# Altium schematic sheet Temp_Mux.SchDoc
size A
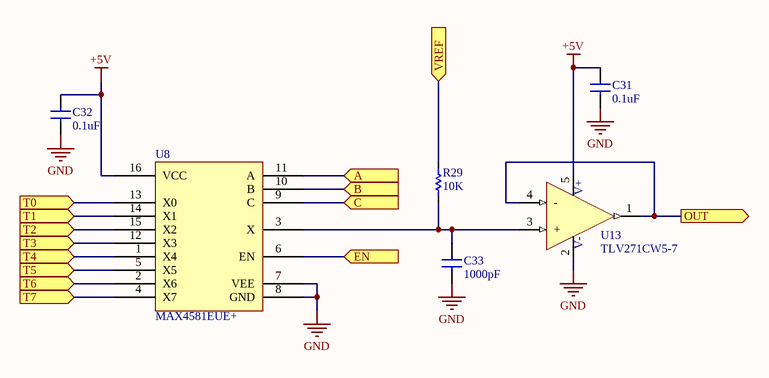
[diagram p0: Temp_Mux.SchDoc]

## Parts
C31  value 0.1uF  [0402_CAPACITOR]  (hidden comment: CAP 0.1uF 16V X7R)
C32  value 0.1uF  [0402_CAPACITOR]  (hidden comment: CAP 0.1uF 16V X7R)
C33  value 1000pF  [0402_CAPACITOR]
R29  value 10K  [0402_Resistor]  (hidden comment: R_0402_10K_1%)
U8  MAX4581EUE+  [TSSOP-16]
U13  TLV271CW5-7  [SOT23-5]

## Ports
A (in), B (in), C (in), EN (in), OUT (out), T0 (in), T1 (in), T2 (in), T3 (in), T4 (in), T5 (in), T6 (in), T7 (in), VREF (in)

## Nets
+5V: C31.1 C32.1 U8.16(VCC) U13.5(VDD)
GND: C31.2 C32.2 C33.2 U8.7(VEE) U8.8(GND) U13.2(GND)
A: U8.11(A) ; port A
B: U8.10(B) ; port B
C: U8.9(C) ; port C
EN: U8.6(EN) ; port EN
OUT: U13.1(OUT) U13.4(-) ; port OUT
T0: U8.13(X0) ; port T0
T1: U8.14(X1) ; port T1
T2: U8.15(X2) ; port T2
T3: U8.12(X3) ; port T3
T4: U8.1(X4) ; port T4
T5: U8.5(X5) ; port T5
T6: U8.2(X6) ; port T6
T7: U8.4(X7) ; port T7
VREF: R29.2 ; port VREF
NetC33_1: C33.1 R29.1 U8.3(X) U13.3(+)

## Notes on the sheet
- (in symbol U_TLV271) V+; V-

## Library data of the parts
C31 C32 = C_0402_0.1uF_16V_10%: CAP CERM 0.1uF 10% 16V 0402; Package: =SelectedPackage; Voltage: 16V; Temperature Coefficient: X7R; Supplier 1: Digi-Key; Supplier Part Number 1: 1276-1001-1-ND; Supplier 2: Digi-Key; Supplier Part Number 2: 587-1451-1-ND
C33 = C_0402_generic_C0G/NP0_50V_5%: Generic 0402 C0G/NP0 50V 5% ceramic capacitor / Valid values range from 10pF to 1000pF with E24 selection (1.0, 1.1, 1.2, 1.3, 1.5, 1.6, 1.8, 2.0, 2.2, 2.4, 2.7, 3.0, 3.3, 3.6, 3.9, 4.3, 4.7, 5.1, 5.6, 6.2, 6.8, 7.5, 8.2, 9.1), although E12 are more common; Manufacturer: Samsung; Temperature Coefficient: C0G, NP0; Package: =SelectedPackage; Voltage: 50V; ValueFormatted: =Copy(Value,0,2)+Copy('012',Pos('p',Value)-2,1); Manufacturer Part Number: ='CL05C'+ValueFormatted+'JB5NNNC'; HelpURL: https://www.digikey.com/products/en/capacitors/ceramic-capacitors/60?k=&pkeyword=&sv=0&pv405=19&sf=0&FV=fffc04fc%2Cc0002%2Cc0003%2C1c0002%2C380020%2C400004%2C440012%2C3f00019%2C1f140000%2Cffe0003c%2Cmu1000pF%7C2049%2Cmu100pF%7C2049%2Cmu10pF%7C2049%2Cmu11pF%7C2049%2Cmu120pF%7C2049%2Cmu12pF%7C2049%2Cmu13pF%7C2049%2Cmu150pF%7C2049%2Cmu15pF%7C2049%2Cmu16pF%7C2049%2Cmu180pF%7C2049%2Cmu18pF%7C2049%2Cmu200pF%7C2049%2Cmu20pF%7C2049%2Cmu220pF%7C2049%2Cmu22pF%7C2049%2Cmu24pF%7C2049%2Cmu270pF%7C2049%2Cmu27pF%7C2049%2Cmu30pF%7C2049%2Cmu330pF%7C2049%2Cmu33pF%7C2049%2Cmu36pF%7C2049%2Cmu390pF%7C2049%2Cmu39pF%7C2049%2Cmu470pF%7C2049%2Cmu47pF%7C2049%2Cmu51pF%7C2049%2Cmu560pF%7C2049%2Cmu56pF%7C2049%2Cmu62pF%7C2049%2Cmu680pF%7C2049%2Cmu68pF%7C2049%2Cmu75pF%7C2049%2Cmu820pF%7C2049%2Cmu82pF%7C2049%2Cmu91pF%7C2049&ColumnSort=2049
R29 = R_0402_generic_1%: Generic 0402 Resistor (10.2R to 10M); Manufacturer: Yageo; Power Rating: 0.0625W; Temperature Coefficient: ±100ppm/°C; Tolerance: ±1%; Voltage Rating: 50V; Operating Temperature: -55°C ~ 155°C; Manufacturer Part Number: ='RC0402FR-07'+ValueFormatted+'L'; HelpURL: https://www.digikey.com/products/en/resistors/chip-resistor-surface-mount/52?pv17=103&FV=fffc000d%2Cc0001%2C1c0002%2C1f140000%2Cffe00034&k=RC0402; ValueFormatted: =Copy(Copy(Value, 0, Pos('.', Value)-1)+Copy(Value, Length(Value), 1)+Copy(Value, Pos('.', Value)+1, Length(Value)-Pos('.', Value)-1),1,Pos('.',Value)*Length(Value))+Copy(Value,1,Length(Value)*(1-Pos('.',Value)))
U8 = U_MAX4581: 1 Circuit IC Switch 8:1 80 Ohm 16-TSSOP; Supplier 1: Digi-Key; Supplier Part Number 1: MAX4581EUE+-ND
U13 = U_TLV271: CMOS Amplifier 1 Circuit Rail-to-Rail SOT-25; Manufacturer: Diodes; Output Current per Channel: 8mA; Power Dissipation: 220mW; Min Dual Supply Voltage: 1.35V; Operating Supply Current: 550uA; Common Mode Rejection Ratio: 65dB; Voltage Gain: 110dB; Slew Rate: 2V/µs; Input Bias Current: 1pA; Power Supply Rejection Ratio (PSRR): 70dB; Input Offset Voltage (Vos): 500uV; Unity Gain Bandwidth Product: 1.9MHz; Max Supply Voltage: 16V; Max Frequency: 10kHz; Min Supply Voltage: 2.7V; Supplier 1: Digi-Key; Supplier Part Number 1: TLV271CW5-7DIDKR-ND; Width: 1.7mm; Max Operating Temperature: 70°C; Min Operating Temperature: 0°C; Manufacturer Part Number: TLV271CW5-7; Gain Bandwidth Product: 1.9MHz